# Altium schematic sheet PERIPHERALS.SchDoc
size A4; SheetNumber: 4; SheetTotal: 7
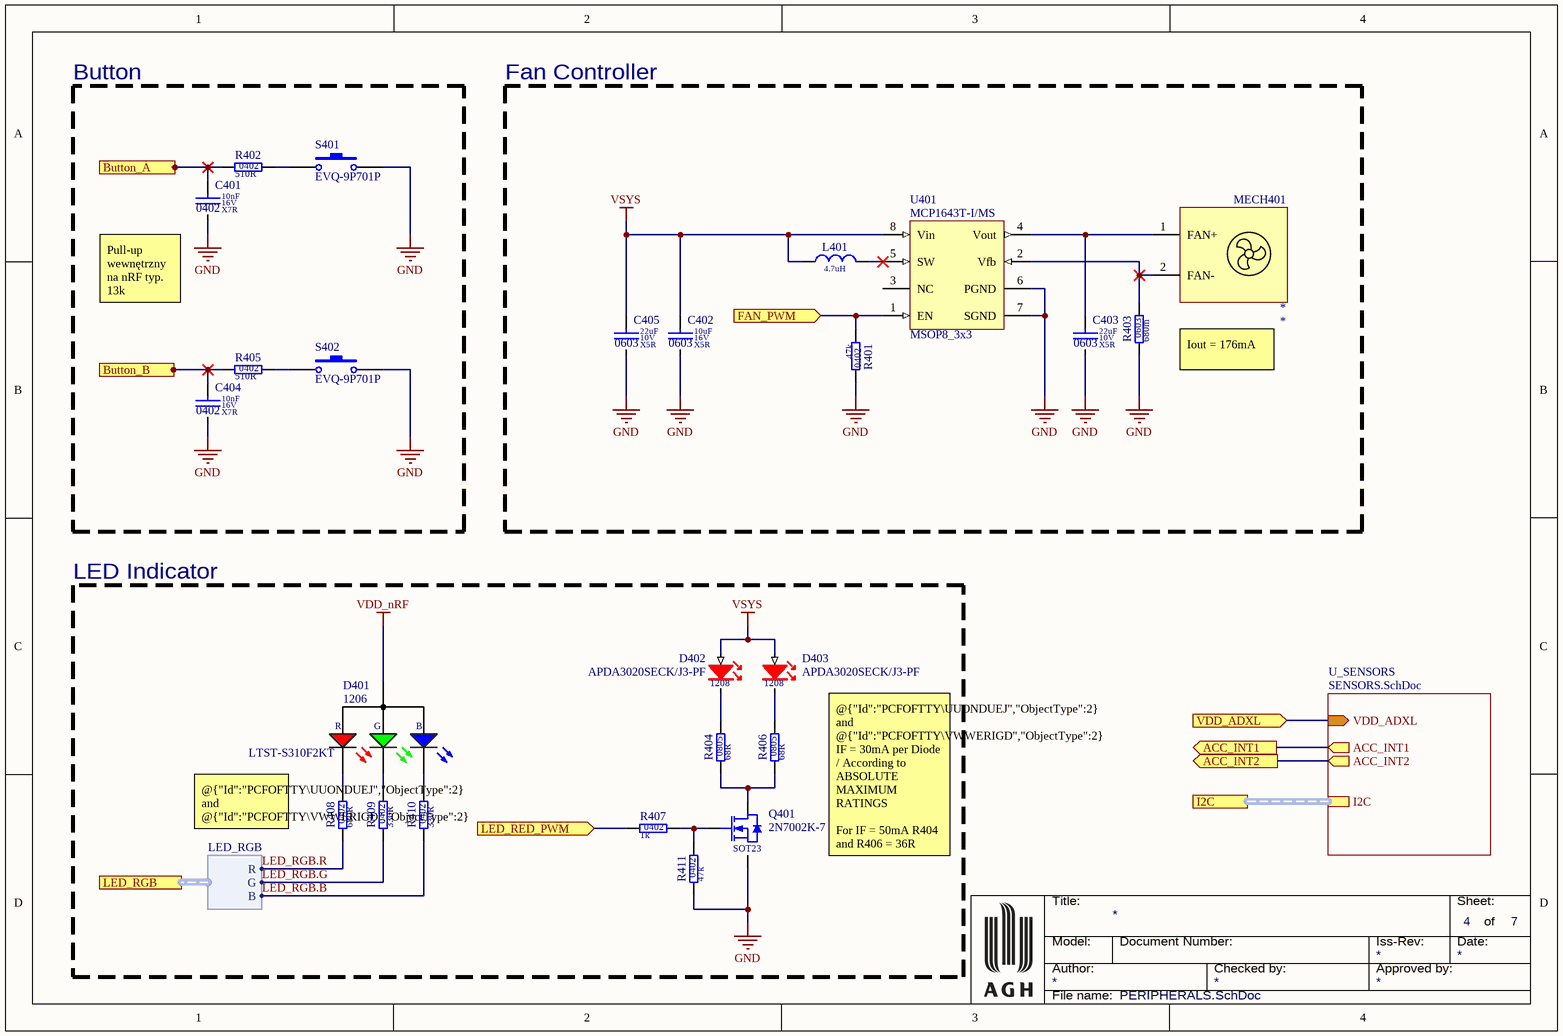
[diagram p0: PERIPHERALS.SchDoc]

## Parts
C401  value 10nF  Dielectric: X7R  Voltage: 16V  SCH_Footprint: 0402  [C_0402_1005]  (hidden comment: Ceramic Capacitor)
C402  value 10uF  Dielectric: X5R  Voltage: 16V  SCH_Footprint: 0603  [C_0603_1608]  (hidden comment: Ceramic X5R)
C403  value 22uF  Dielectric: X5R  Voltage: 10V  SCH_Footprint: 0603  [C_0603_1608]  (hidden comment: Ceramic X5R)
C404  value 10nF  Dielectric: X7R  Voltage: 16V  SCH_Footprint: 0402  [C_0402_1005]  (hidden comment: Ceramic Capacitor)
C405  value 22uF  Dielectric: X5R  Voltage: 10V  SCH_Footprint: 0603  [C_0603_1608]  (hidden comment: Ceramic X5R)
D401  value LTST-S310F2KT  SCH_Footprint: 1206  [OL_RGB_LTST-S310F2KT]  (hidden comment: RGB smd)
D402  value APDA3020SECK/J3-PF  SCH_Footprint: 1208  [OL_R_APDA3020SECK]  (hidden comment: Red LED right angle)
D403  value APDA3020SECK/J3-PF  SCH_Footprint: 1208  [OL_R_APDA3020SECK]  (hidden comment: Red LED right angle)
L401  value 4.7uH  [L_WE-TPC_2813]  (hidden comment: Inductor)
MECH401  MECH_FAN_4010  [FAN_4010_PAD]  (value not drawn)
Q401  SCH_Footprint: SOT23  [SOT23_TO236_SC59]  (hidden comment: 2N7002K-7)
R401  value 47k  SCH_Footprint: 0402  [R_0402_1005]  (hidden comment: Resistor)
R402  value 510R  SCH_Footprint: 0402  [R_0402_1005]  (hidden comment: Resistor)
R403  value 680m  SCH_Footprint: 0603  [R_0603_1608]  (hidden comment: Resistor)
R404  value 68R  SCH_Footprint: 0805  [R_NC_0805_2012]  (hidden comment: Resistor)
R405  value 510R  SCH_Footprint: 0402  [R_0402_1005]  (hidden comment: Resistor)
R406  value 68R  SCH_Footprint: 0805  [R_NC_0805_2012]  (hidden comment: Resistor)
R407  value 1k  SCH_Footprint: 0402  [R_0402_1005]  (hidden comment: Resistor)
R408  value 680R  SCH_Footprint: 0402  [R_0402_1005]  (hidden comment: Resistor)
R409  value 330R  SCH_Footprint: 0402  [R_0402_1005]  (hidden comment: Resistor)
R410  value 330R  SCH_Footprint: 0402  [R_0402_1005]  (hidden comment: Resistor)
R411  value 47k  SCH_Footprint: 0402  [R_0402_1005]  (hidden comment: Resistor)
S401  value EVQ-9P701P  [EVQ-9P701P]  (hidden comment: Light Touch Switch, 4.7X3.5Mm, Smd)
S402  value EVQ-9P701P  [EVQ-9P701P]  (hidden comment: Light Touch Switch, 4.7X3.5Mm, Smd)
U401  value MCP1643T-I/MS  SCH_Footprint: MSOP8_3x3  [MSOP8_TSSOP8_3X3]  (hidden comment: MCP1643)

## Blocks framed on the sheet
Button: C401 C404 R402 R405 S401 S402
Fan Controller: C402 C403 C405 L401 MECH401 R401 R403 U401
LED Indicator: D401-D403 Q401 R404 R406-R411

## Sub-sheets
U_SENSORS = SENSORS.SchDoc: I2C (harness I2C), ACC_INT1 (out), ACC_INT2 (out), VDD_ADXL (in)

## Ports
ACC_INT1 (out, see Main[3C], nRF52833[3A], SENSORS[4C]), ACC_INT2 (out, see Main[3C], nRF52833[3A], SENSORS[4C]), Button_A (out, see Main[3B], nRF52833[3B]), Button_B (out, see Main[3B], nRF52833[3B]), FAN_PWM (in, see Main[3B], nRF52833[3B]), I2C (harness I2C, see Main[3C], nRF52833[4C], SENSORS[4B]), LED_RED_PWM (in, see Main[3B], nRF52833[3B]), LED_RGB (harness LED_RGB, see Main[3B], nRF52833[4C]), VDD_ADXL (in, see Main[3B], nRF52833[3B], SENSORS[1B])

## Harnesses
LED_RGB: R, G, B

## Nets
GND: C401.2 C402.2 C403.2 C404.2 C405.2 Q401.2(S) R401.2 R403.1 R411.1 S401.2 S402.2 U401.6(PGND) U401.7(SGND)
VDD_nRF: D401.4(A)
VSYS: C402.1 C405.1 D402.2(A) D403.2(A) L401.1 U401.8(Vin)
ACC_INT1: port ACC_INT1, sheet U_SENSORS/ACC_INT1
ACC_INT2: port ACC_INT2, sheet U_SENSORS/ACC_INT2
Button_A: C401.1 R402.1 ; port Button_A
Button_B: C404.1 R405.1 ; port Button_B
FAN_PWM: R401.1 U401.1(EN) ; port FAN_PWM
LED_RED_PWM: R407.1 ; port LED_RED_PWM
LED_RGB.B: R410.1 ; port LED_RGB.B
LED_RGB.G: R409.1 ; port LED_RGB.G
LED_RGB.R: R408.1 ; port LED_RGB.R
VDD_ADXL: port VDD_ADXL, sheet U_SENSORS/VDD_ADXL
NetC403_1: C403.1 MECH401.1(FAN+) U401.4(Vout)
NetD401_1: D401.1(R) R408.2
NetD401_2: D401.2(G) R409.2
NetD401_3: D401.3(B) R410.2
NetD402_1: D402.1(K) R404.2
NetD403_1: D403.1(K) R406.2
NetL401_2: L401.2 U401.5(SW)
NetMECH401_2: MECH401.2(FAN-) R403.2 U401.2(Vfb)
NetQ401_1: Q401.1(G) R407.2 R411.2
NetQ401_3: Q401.3(D) R404.1 R406.1
NetR402_2: R402.2 S401.1
NetR405_2: R405.2 S402.1

Not connected (* = marked no-connect by the designer): U401 3(NC)

## Buses and harness runs
harness port I2C = sheet U_SENSORS/I2C

## Notes on the sheet
- (near C401) Pull-up wewnętrzny na nRF typ. 13k
- Iout = 176mA
- @{"Id":"PCFOFTTY\UUONDUEJ","ObjectType":2} and @{"Id":"PCFOFTTY\VWWERIGD","ObjectType":2} IF = 2mA
- @{"Id":"PCFOFTTY\UUONDUEJ","ObjectType":2} and @{"Id":"PCFOFTTY\VWWERIGD","ObjectType":2} IF = 30mA per Diode / According to  ABSOLUTE MAXIMUM RATINGS
  For IF = 50mA R404 and R406 = 36R
- Title:
- Sheet:
- of
- Author:
- Model:
- Document Number:
- Checked by:
- Iss-Rev:
- Approved by:
- Date:
- File name:

## Library data of the parts
C401 C404 = C_10nF_16V_X7R_0402_10: Capacitor; Manufacturer: Yageo; Manufacturer Part Number: CC0402KRX7R7BB103; Tolerance (%): 10; Part Number: C_10nF_16V_X7R_0402_10; HelpURL: https://datasheet.octopart.com/CC0402KRX7R7BB103-Yageo-datasheet-10883670.pdf; Supplier 1: TME; Supplier Part Number 1: CC0402KRX7R7103; Supplier 2: RS Components; Supplier Part Number 2: 6698688; Supplier 3: Farnell; Supplier Part Number 3: 3019275; Supplier 4: Mouser; Supplier Part Number 4: 603-CC402KRX7R7BB103; Supplier 5: Digi-Key; Supplier Part Number 5: 311-1042-1-ND; Supplier 6: LCSC
C402 = C_10uF_16V_X5R_0603_20: Capacitor; Manufacturer: Samsung; Manufacturer Part Number: CL10A106MO8NQNC; Tolerance (%): 20; Part Number: C_10uF_16V_X5R_0603_20; HelpURL: http://www.tme.eu/pl/Document/4a42202b32dab16128fe107dd69598cc/samsung-chip-cap.pdf; Supplier 1: TME; Supplier Part Number 1: CL10A106MO8NQNC; Supplier 2: RS Components; Supplier 3: Farnell; Supplier 4: Mouser; Supplier Part Number 4: 187-CL10A106MO8NQNC; Supplier 5: Digi-Key; Supplier Part Number 5: 1276-1870-1-ND; Supplier 6: LCSC
C403 C405 = C_22uF_10V_X5R_0603_20: Capacitor; Manufacturer: Murata; Manufacturer Part Number: GRM188R61A226ME15D; Tolerance (%): 20; Part Number: C_22uF_10V_X5R_0603_20; HelpURL: https://www.mouser.pl/datasheet/2/281/1/GRM188R61A226ME15_02A-1985787.pdf; Supplier 1: TME; Supplier Part Number 1: GRM188R61A226ME15D; Supplier 2: RS Components; Supplier 3: Farnell; Supplier Part Number 3: 2426957; Supplier 4: Mouser; Supplier Part Number 4: 81-GRM188R61A226ME5D; Supplier 5: Digi-Key; Supplier Part Number 5: 490-10476-1-ND; Supplier 6: LCSC
D401 = OL_RGB_LTST-S310F2KT: Manufacturer: Lite-On; Part Number: OL_RGB_LTST-S310F2KT; HelpURL: http://docs-europe.electrocomponents.com/webdocs/0dc0/0900766b80dc0b91.pdf; Manufacturer Part Number: LTST-S310F2KT; Supplier 1: TME; Supplier Part Number 1: LTST-S310F2KT; Supplier 2: RS Components; Supplier Part Number 2: 6921348P; Supplier 3: Farnell; Supplier 4: Mouser; Supplier Part Number 4: 859-LTST-S310F2KT; Supplier 5: Digi-Key; Supplier Part Number 5: LTST-S310F2KT-ND; Supplier 6: LCSC
D402 D403 = OL_R_APDA3020SECK/J3-PF: LED_RED; Manufacturer: Kingbright; Part Number: OL_R_APDA3020SECK/J3-PF; HelpURL: https://www.kingbrightusa.com/images/catalog/SPEC/APDA3020SECK-J3-PF.pdf; Manufacturer Part Number: APDA3020SECK/J3-PF; Supplier 1: TME; Supplier 2: RS Components; Supplier 3: Farnell; Supplier 4: Mouser; Supplier Part Number 4: 604-APDA3020SECKJ3PF; Supplier 5: Digi-Key; Supplier Part Number 5: 754-1781-1-ND; Supplier 6: LCSC
L401 = L_4.7uH_1A_WE-TPC: Induction; Manufacturer: Wurth Elektronik; Manufacturer Part Number: 744029004; SCH_Footprint: WE-TPC; Current: 1A; Resistance: 200mR; Part Number: L_4.7uH_1A_WE-TPC; HelpURL: https://www.we-online.com/components/products/datasheet/744029004.pdf; Supplier 1: TME; Supplier 2: RS Components; Supplier Part Number 2: 6690176P; Supplier 3: Farnell; Supplier Part Number 3: 1635826; Supplier 4: Mouser; Supplier Part Number 4: 710-744029004; Supplier 5: Digi-Key; Supplier Part Number 5: 732-1089-1-ND; Supplier 6: LCSC; Supplier 7: WinSource; Supplier Part Number 7: 857207-744029004
Q401 = QN_2N7002K-7: Manufacturer: Diodes Inc; Type: N-MOS; Voltage: 60V; Current: 0A8; Value: 2N7002K-7; Part Number: QN_2N7002K-7; HelpURL: http://datasheet.octopart.com/2N7002K-7-Diodes-Inc.-datasheet-12515815.pdf; Manufacturer Part Number: 2N7002K-7; Supplier 1: TME; Supplier 2: RS Components; Supplier Part Number 2: 7703383; Supplier 3: Farnell; Supplier Part Number 3: 1713825; Supplier 4: Mouser; Supplier Part Number 4: 621-2N7002K-7; Supplier 5: Digi-Key; Supplier Part Number 5: 2N7002K-7DICT-ND; Supplier 6: LCSC
R401 R411 = R_47k_0402_1: Manufacturer: Yageo; Manufacturer Part Number: RC0402FR-0747KL; Voltage: 50V; Power: 63mW; Tolerance: 1%; Part Number: R_47k_0402_1; HelpURL: https://datasheet.octopart.com/RC0402FR-0747KL-Yageo-datasheet-10408619.pdf; Supplier 1: TME; Supplier Part Number 1: RC0402FR-0747KL; Supplier 2: RS Components; Supplier 3: Farnell; Supplier Part Number 3: 2421898; Supplier 4: Mouser; Supplier Part Number 4: 603-RC0402FR-0747KL; Supplier 5: Digi-Key; Supplier Part Number 5: 311-47.0KLRCT-ND; Supplier 6: LCSC
R402 R405 = R_510R_0402_1_AECQ0: Manufacturer: Panasonic; Manufacturer Part Number: ERJ-2RKF5100X; Voltage: 50V; Power: 100mW; Tolerance: 1%; AEC-Q: 0; Part Number: R_510R_0402_1_AECQ0; HelpURL: https://datasheet.octopart.com/Precision-Thick-Film-Chip-Resistors-Panasonic-datasheet-family-106.pdf; Supplier 1: TME; Supplier Part Number 1: ERJ2RKF5100X; Supplier 2: RS Components; Supplier Part Number 2: 176-3562; Supplier 3: Farnell; Supplier Part Number 3: 2302602; Supplier 4: Mouser; Supplier Part Number 4: 667-ERJ-2RKF5100X; Supplier 5: Digi-Key; Supplier Part Number 5: P510LCT-ND; Supplier 6: LCSC
R403 = R_680m_0603_1: Manufacturer: TE Connectivity; Manufacturer Part Number: RLP73K1JR68FTDF; Voltage: 290mV; Power: 125mW; Tolerance: 1%; Part Number: R_680m_0603_1; HelpURL: https://www.te.com/commerce/DocumentDelivery/DDEController?Action=showdoc&DocId=Data+Sheet%7F1773269%7FL%7Fpdf%7FEnglish%7FENG_DS_1773269_L.pdf%7F2-2176051-8; Supplier 1: TME; Supplier 2: RS Components; Supplier 3: Farnell; Supplier 4: Mouser; Supplier Part Number 4: 279-RLP73K1JR68FTDF; Supplier 5: Digi-Key; Supplier Part Number 5: A109584CT-ND; Supplier 6: LCSC
R404 R406 = R_GENERIC_0805: Part Number: R_GENERIC_0805; HelpURL: -; Manufacturer: -; Manufacturer Part Number: -; Supplier 1: TME; Supplier 2: RS Components; Supplier 3: Farnell; Supplier 4: Mouser; Supplier 5: Digi-Key; Supplier 6: LCSC
R407 = R_1k_0402_1: Manufacturer: Yageo; Manufacturer Part Number: RC0402FR-071K; Voltage: 50V; Power: 63mW; Tolerance: 1%; Part Number: R_1k_0402_1; HelpURL: http://www.tme.eu/pl/Document/1a2bc76e2be68b3b1670068306778ce6/rc0402yageo.pdf; Supplier 1: TME; Supplier Part Number 1: RC0402FR-071K; Supplier 2: RS Components; Supplier 3: Farnell; Supplier Part Number 3: 9239235; Supplier 4: Mouser; Supplier Part Number 4: 603-RC0402FR-071KP; Supplier 5: Digi-Key; Supplier Part Number 5: 311-1.00KLRCT-ND; Supplier 6: LCSC
R408 = R_680R_0402_1: Manufacturer: Vishay; Manufacturer Part Number: CRCW0402680RFKED; Voltage: 50V; Power: 63mW; Tolerance: 1%; Part Number: R_680R_0402_1; HelpURL: https://pl.mouser.com/datasheet/2/427/dcrcwe3-1762152.pdf; Supplier 1: TME; Supplier 2: RS Components; Supplier Part Number 2: 678-9510; Supplier 3: Farnell; Supplier Part Number 3: 2140759; Supplier 4: Mouser; Supplier Part Number 4: 71-CRCW0402-680-E3; Supplier 5: Digi-Key; Supplier Part Number 5: 541-680LCT-ND; Supplier 6: LCSC
R409 R410 = R_330R_0402_1_AECQ0: Manufacturer: Panasonic; Manufacturer Part Number: ERJ-2RKF3300X; Voltage: 50V; Power: 100mW; Tolerance: 1%; AEC-Q: 0; Part Number: R_330R_0402_1_AECQ0; HelpURL: http://datasheet.octopart.com/ERJ2RKF3300X-Panasonic-datasheet-13266541.pdf; Supplier 1: TME; Supplier 2: RS Components; Supplier Part Number 2: 7325444; Supplier 3: Farnell; Supplier Part Number 3: 2302581; Supplier 4: Mouser; Supplier Part Number 4: 667-ERJ-2RKF3300X; Supplier 5: Digi-Key; Supplier Part Number 5: P330LCT-ND; Supplier 6: LCSC
S401 S402 = S_EVQ-9P701P: Tact Switch; Manufacturer: Panasonic; Part Number: S_EVQ-9P701P; HelpURL: https://www.mouser.pl/datasheet/2/315/PANAS45028_1-2560407.pdf; Manufacturer Part Number: EVQ-9P701P; Supplier 1: TME; Supplier 2: RS Components; Supplier 3: Farnell; Supplier 4: Mouser; Supplier Part Number 4: 667-EVQ-9P701P; Supplier 5: Digi-Key; Supplier Part Number 5: P19095CT-ND; Supplier 6: LCSC
U401 = VS_MCP1643/MS: Manufacturer: Microchip; Frequency (kHz): 1000; Topology: Boost; Vin min (V): 0,65; Vin max (V): 5; Vout min (V): 0,6; Imax (A): 0,55; Iswitch (A): 0; Part Number: VS_MCP1643/MS; Vout max (V): 5; HelpURL: https://ww1.microchip.com/downloads/aemDocuments/documents/APID/ProductDocuments/DataSheets/MCP1643-Data-Sheet-DS20005208.pdf; Manufacturer Part Number: MCP1643T-I/MS; Supplier 1: TME; Supplier Part Number 1: MCP1643-I/MS; Supplier 2: RS Components; Supplier 3: Farnell; Supplier 4: Mouser; Supplier Part Number 4: 579-MCP1643T-I/MS; Supplier 5: Digi-Key; Supplier Part Number 5: MCP1643T-I/MSCT-ND; Supplier 6: LCSC
MECH401 = MECH_FAN_4010: SCH_Footprint: *; Value: *